# EAGLE design cm_ADA4522 (EAGLE 8.5.0)

## Sheet 1 of 2
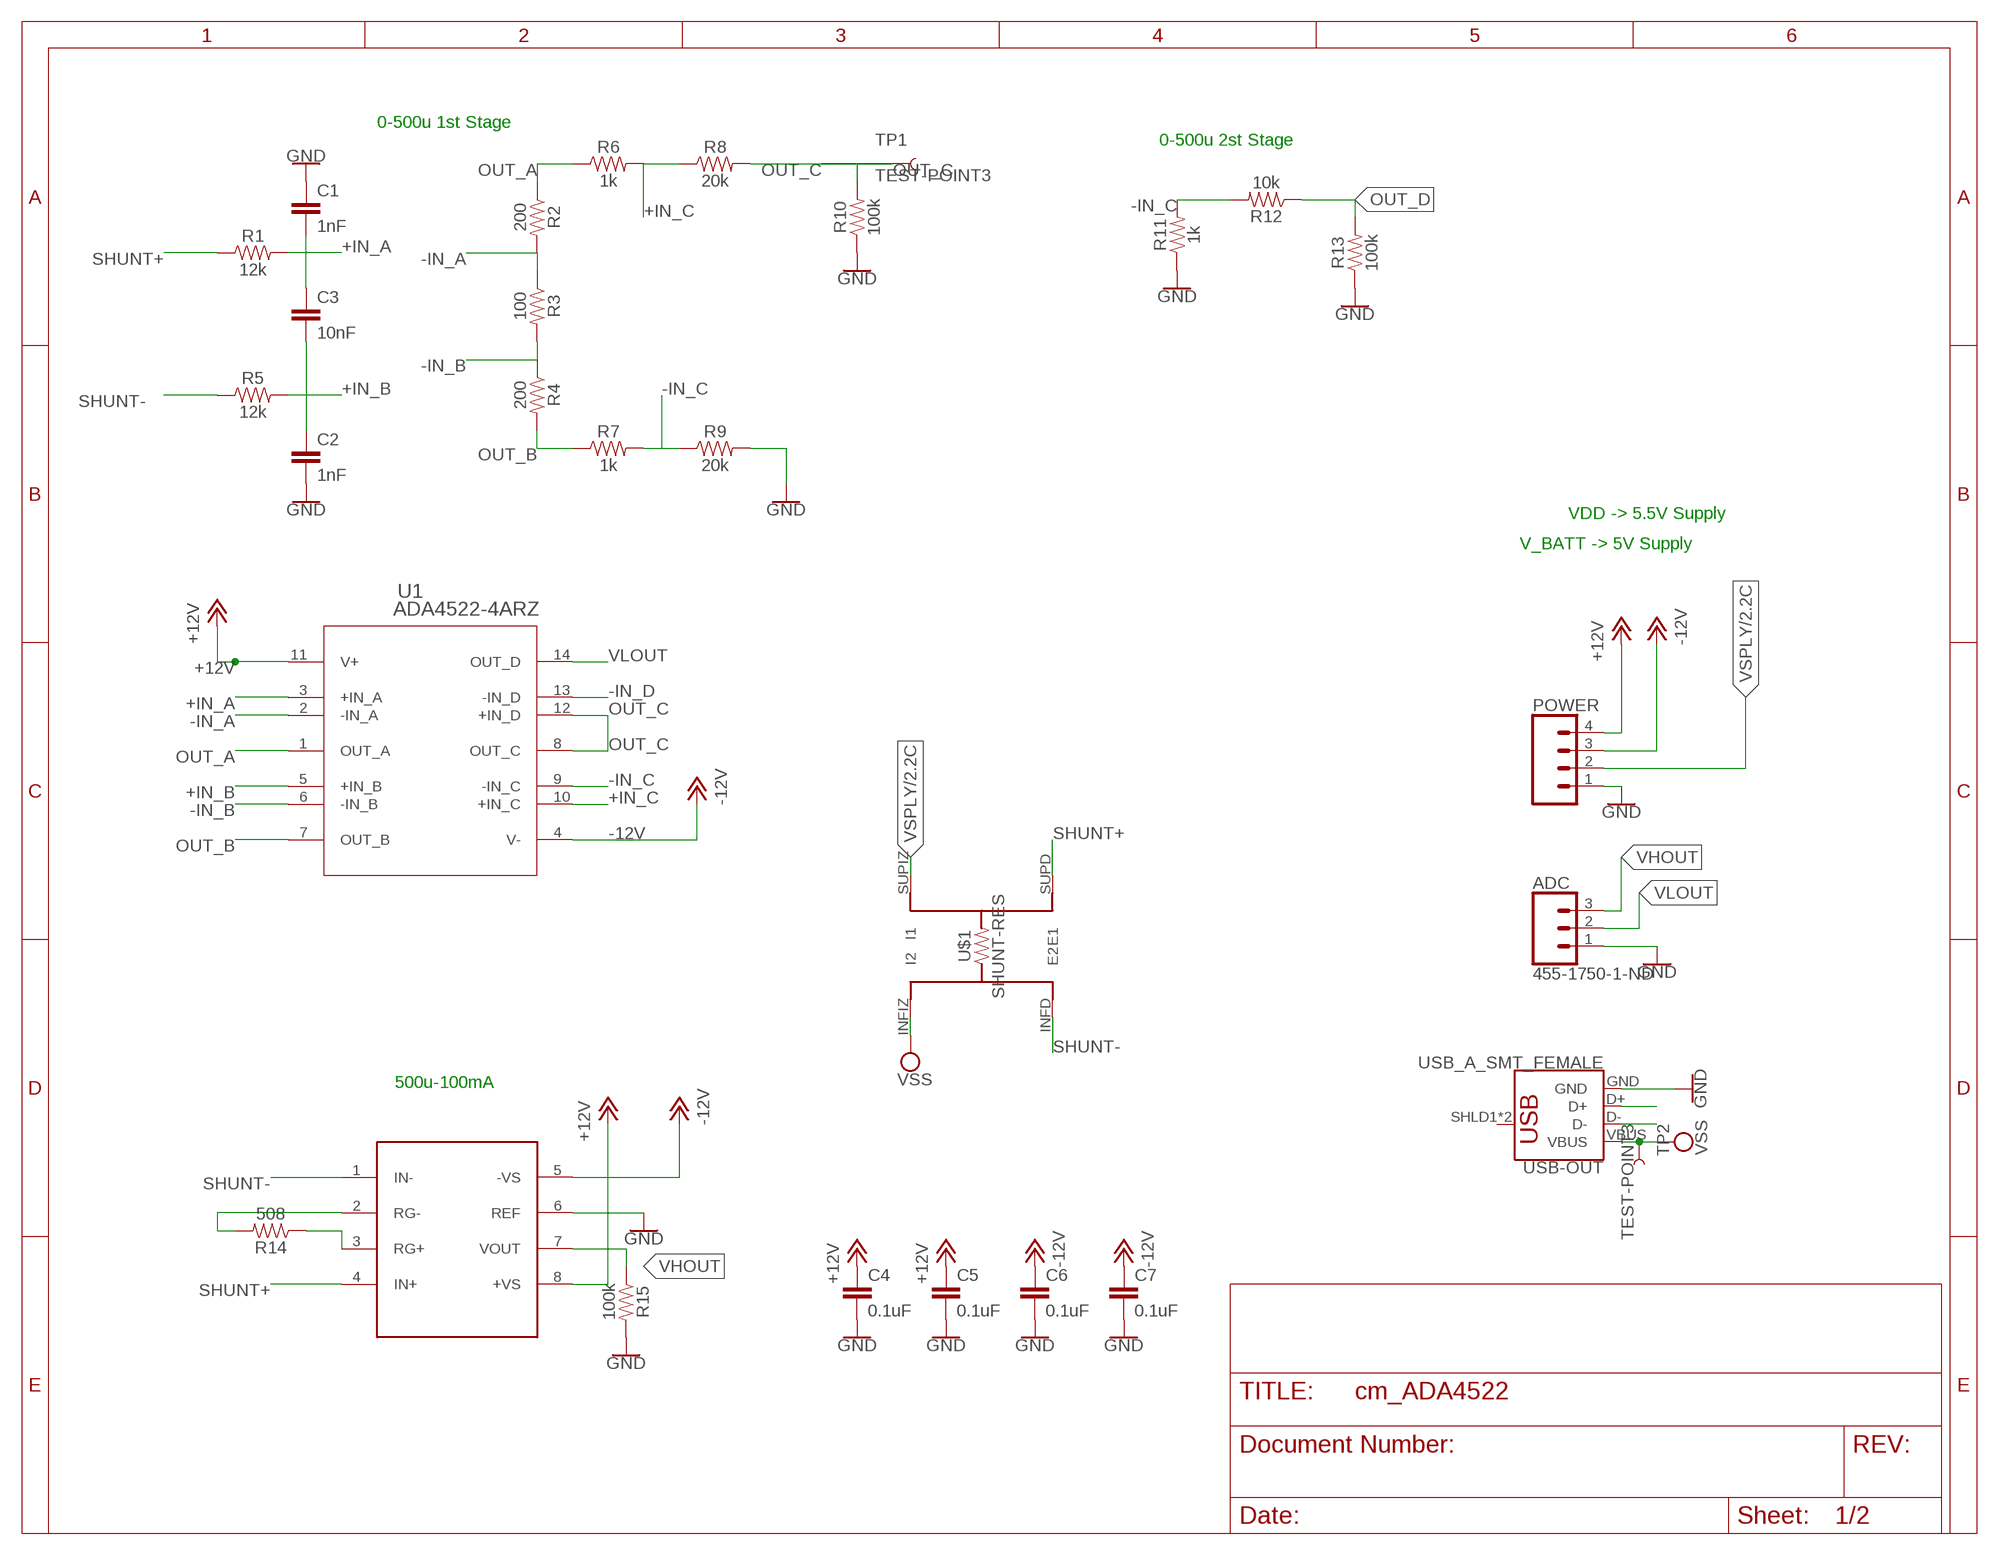
[diagram p0: schematic, sheet 1, part 1 of 2]
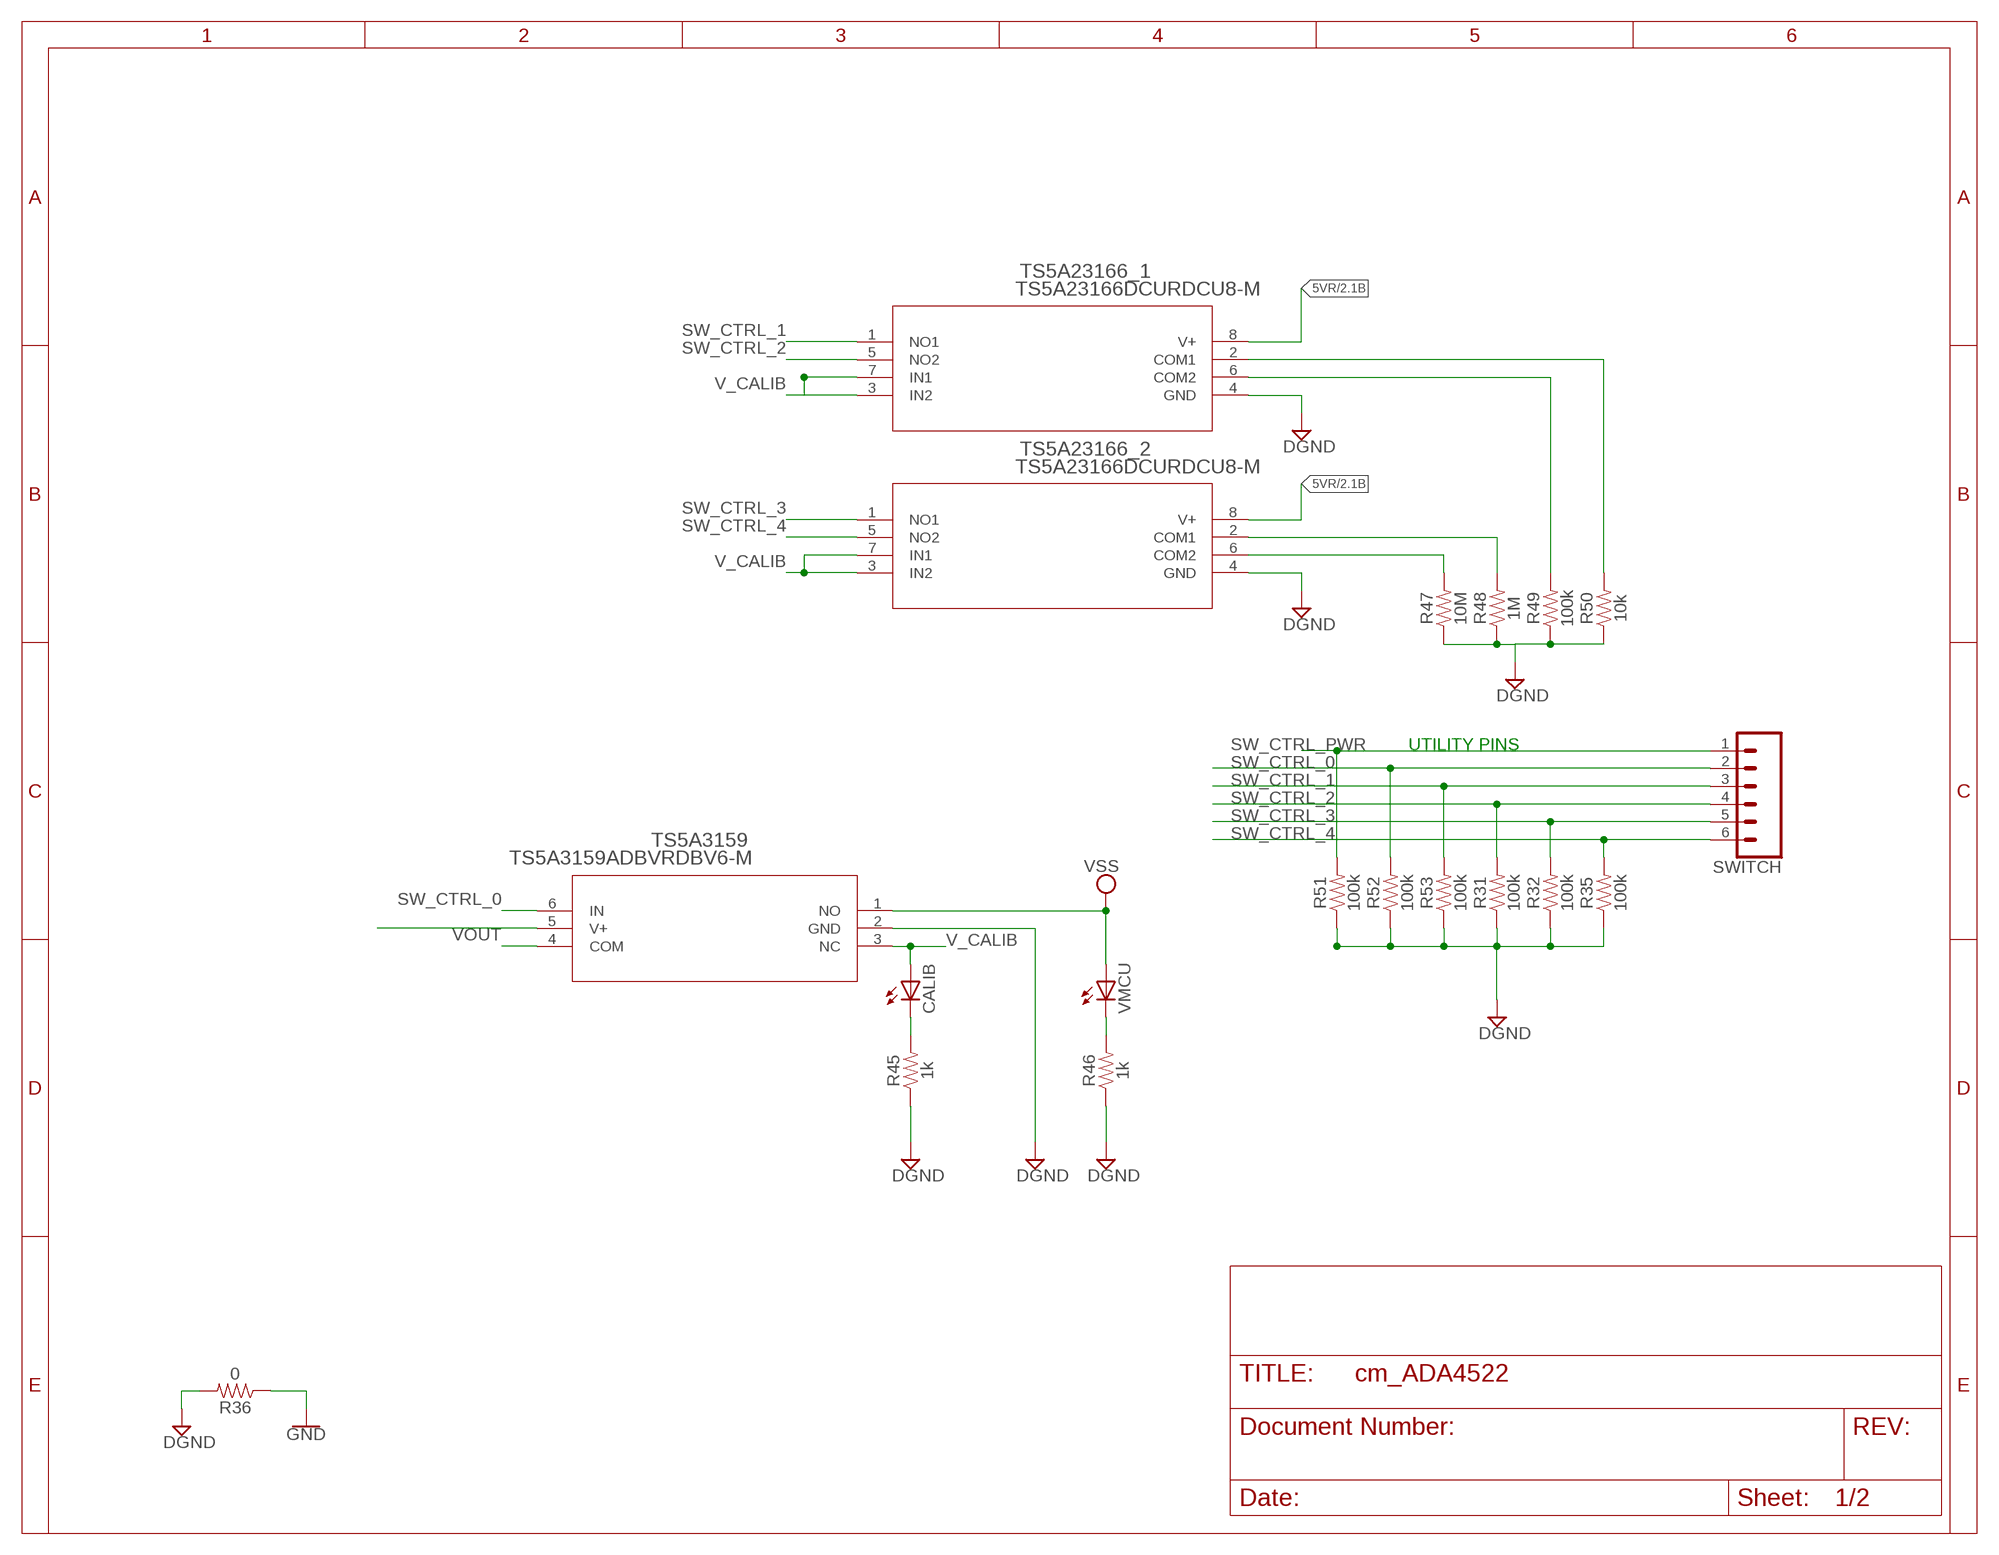
[diagram p1: schematic, sheet 1, part 2 of 2]

### Parts
AD8422  AD8422  [SO08]
ADC  455-1750-1-ND  CONN_03  [1X03]
C1  1nF  3.0NF-0603-50V-5%  [0603]
C2  1nF  3.0NF-0603-50V-5%  [0603]
C3  10nF  3.0NF-0603-50V-5%  [0603]
C4  0.1uF  3.0NF-0603-50V-5%  [0603]
C5  0.1uF  3.0NF-0603-50V-5%  [0603]
C6  0.1uF  3.0NF-0603-50V-5%  [0603]
C7  0.1uF  3.0NF-0603-50V-5%  [0603]
CALIB  LEDCHIPLED_0603  [CHIPLED_0603]
POWER  CONN_04  [1X04]
R1  12k  8.2KOHM-0603-1/10W-5%  [0603]
R2  200  8.2KOHM-0603-1/10W-5%  [0603]
R3  100  8.2KOHM-0603-1/10W-5%  [0603]
R4  200  8.2KOHM-0603-1/10W-5%  [0603]
R5  12k  8.2KOHM-0603-1/10W-5%  [0603]
R6  1k  8.2KOHM-0603-1/10W-5%  [0603]
R7  1k  8.2KOHM-0603-1/10W-5%  [0603]
R8  20k  8.2KOHM-0603-1/10W-5%  [0603]
R9  20k  8.2KOHM-0603-1/10W-5%  [0603]
R10  100k  8.2KOHM-0603-1/10W-5%  [0603]
R11  1k  8.2KOHM-0603-1/10W-5%  [0603]
R12  10k  8.2KOHM-0603-1/10W-5%  [0603]
R13  100k  8.2KOHM-0603-1/10W-5%  [0603]
R14  508  8.2KOHM-0603-1/10W-5%  [0603]
R15  100k  8.2KOHM-0603-1/10W-5%  [0603]
R31  100k  8.2KOHM-0603-1/10W-5%  [0603]
R32  100k  8.2KOHM-0603-1/10W-5%  [0603]
R35  100k  8.2KOHM-0603-1/10W-5%  [0603]
R36  0  8.2KOHM-0603-1/10W-5%  [0603]
R45  1k  8.2KOHM-0603-1/10W-5%  [0603]
R46  1k  8.2KOHM-0603-1/10W-5%  [0603]
R47  10M  8.2KOHM-0603-1/10W-5%  [0603]
R48  1M  8.2KOHM-0603-1/10W-5%  [0603]
R49  100k  8.2KOHM-0603-1/10W-5%  [0603]
R50  10k  8.2KOHM-0603-1/10W-5%  [0603]
R51  100k  8.2KOHM-0603-1/10W-5%  [0603]
R52  100k  8.2KOHM-0603-1/10W-5%  [0603]
R53  100k  8.2KOHM-0603-1/10W-5%  [0603]
SWITCH  CONN_06LONGPADS  [1X06_LONGPADS]
TP1  TEST-POINT3  [PAD.03X.03]
TP2  TEST-POINT3  [PAD.03X.03]
TS5A3159  TS5A3159ADBVRDBV6-M  [DBV6-M]
TS5A23166_1  TS5A23166DCURDCU8-M  [DCU8-M]
TS5A23166_2  TS5A23166DCURDCU8-M  [DCU8-M]
U1  ADA4522-4ARZ  [R_14]
U$1  SHUNT-RES  [HIPREC-SMD-SHUNT]
USB-OUT  USB_A_SMT_FEMALE  [USB-A-S-SILK-FEMALE]
VMCU  LEDCHIPLED_0603  [CHIPLED_0603]

### Nets
5V_F: TS5A3159.5(V+)
5VR: TS5A23166_1.8(V+) TS5A23166_2.8(V+) ; also sheet 2
+12V: AD8422.8(+VS) C4.1 C5.1 POWER.4 U1.11(V+) ; also sheet 2
+IN_A: C1.2 C3.1 R1.2 U1.3(+IN_A)
+IN_B: C2.1 C3.2 R5.2 U1.5(+IN_B)
+IN_C: R6.2 R8.1 U1.10(+IN_C)
-12V: AD8422.5(-VS) C6.1 C7.1 POWER.3 U1.4(V-) ; also sheet 2
-IN_A: R2.2 R3.1 U1.2(-IN_A)
-IN_B: R3.2 R4.1 U1.6(-IN_B)
-IN_C: R7.2 R9.1 R11.2 R12.2 U1.9(-IN_C)
-IN_D: U1.13(-IN_D)
DATA+: USB-OUT.D+ ; also sheet 2
DATA-: USB-OUT.D- ; also sheet 2
DGND: R31.1 R32.1 R35.1 R36.2 R45.1 R46.1 R47.1 R48.1 R49.1 R50.1 R51.1 R52.1 R53.1 TS5A3159.2(GND) TS5A23166_1.4(GND) TS5A23166_2.4(GND) ; also sheet 2
GND: AD8422.6(REF) ADC.1 C1.1 C2.2 C4.2 C5.2 C6.2 C7.2 POWER.1 R9.2 R10.1 R11.1 R13.1 R15.2 R36.1 USB-OUT.GND ; also sheet 2
N$7: AD8422.2(RG-) R14.2
N$10: AD8422.3(RG+) R14.1
N$23: CALIB.C R45.2
N$24: R46.2 VMCU.C
N$30: R50.2 TS5A23166_1.2(COM1)
N$31: R49.2 TS5A23166_1.6(COM2)
N$32: R48.2 TS5A23166_2.2(COM1)
N$33: R47.2 TS5A23166_2.6(COM2)
OUT_A: R2.1 R6.1 U1.1(OUT_A)
OUT_B: R4.2 R7.1 U1.7(OUT_B)
OUT_C: R8.2 R10.2 TP1.P$1 U1.8(OUT_C) U1.12(+IN_D)
OUT_D: R12.1 R13.2
SHUNT+: AD8422.4(IN+) R1.1 U$1.SUPD(E1)
SHUNT-: AD8422.1(IN-) R5.1 U$1.INFD(E2)
SW_CTRL_0: R52.2 SWITCH.2 TS5A3159.6(IN)
SW_CTRL_1: R53.2 SWITCH.3 TS5A23166_1.1(NO1)
SW_CTRL_2: R31.2 SWITCH.4 TS5A23166_1.5(NO2)
SW_CTRL_3: R32.2 SWITCH.5 TS5A23166_2.1(NO1)
SW_CTRL_4: R35.2 SWITCH.6 TS5A23166_2.5(NO2)
SW_CTRL_PWR: R51.2 SWITCH.1 ; also sheet 2
V_CALIB: CALIB.A TS5A3159.3(NC) TS5A23166_1.3(IN2) TS5A23166_1.7(IN1) TS5A23166_2.3(IN2) TS5A23166_2.7(IN1)
VHOUT: AD8422.7(VOUT) ADC.3 R15.1
VLOUT: ADC.2 U1.14(OUT_D)
VOUT: TS5A3159.4(COM)
VSPLY: POWER.2 U$1.SUPIZ(I1) ; also sheet 2
VSS: TP2.P$1 TS5A3159.1(NO) U$1.INFIZ(I2) USB-OUT.VBUS VMCU.A
Unconnected: USB-OUT.SHLD1(SHIELD) USB-OUT.SHLD2(SHIELD)

### Notes on the sheet
- 0-500u 1st Stage
- 0-500u 2st Stage
- VDD -> 5.5V Supply
- V_BATT -> 5V Supply
- UTILITY PINS
- 500u-100mA

## Sheet 2 of 2
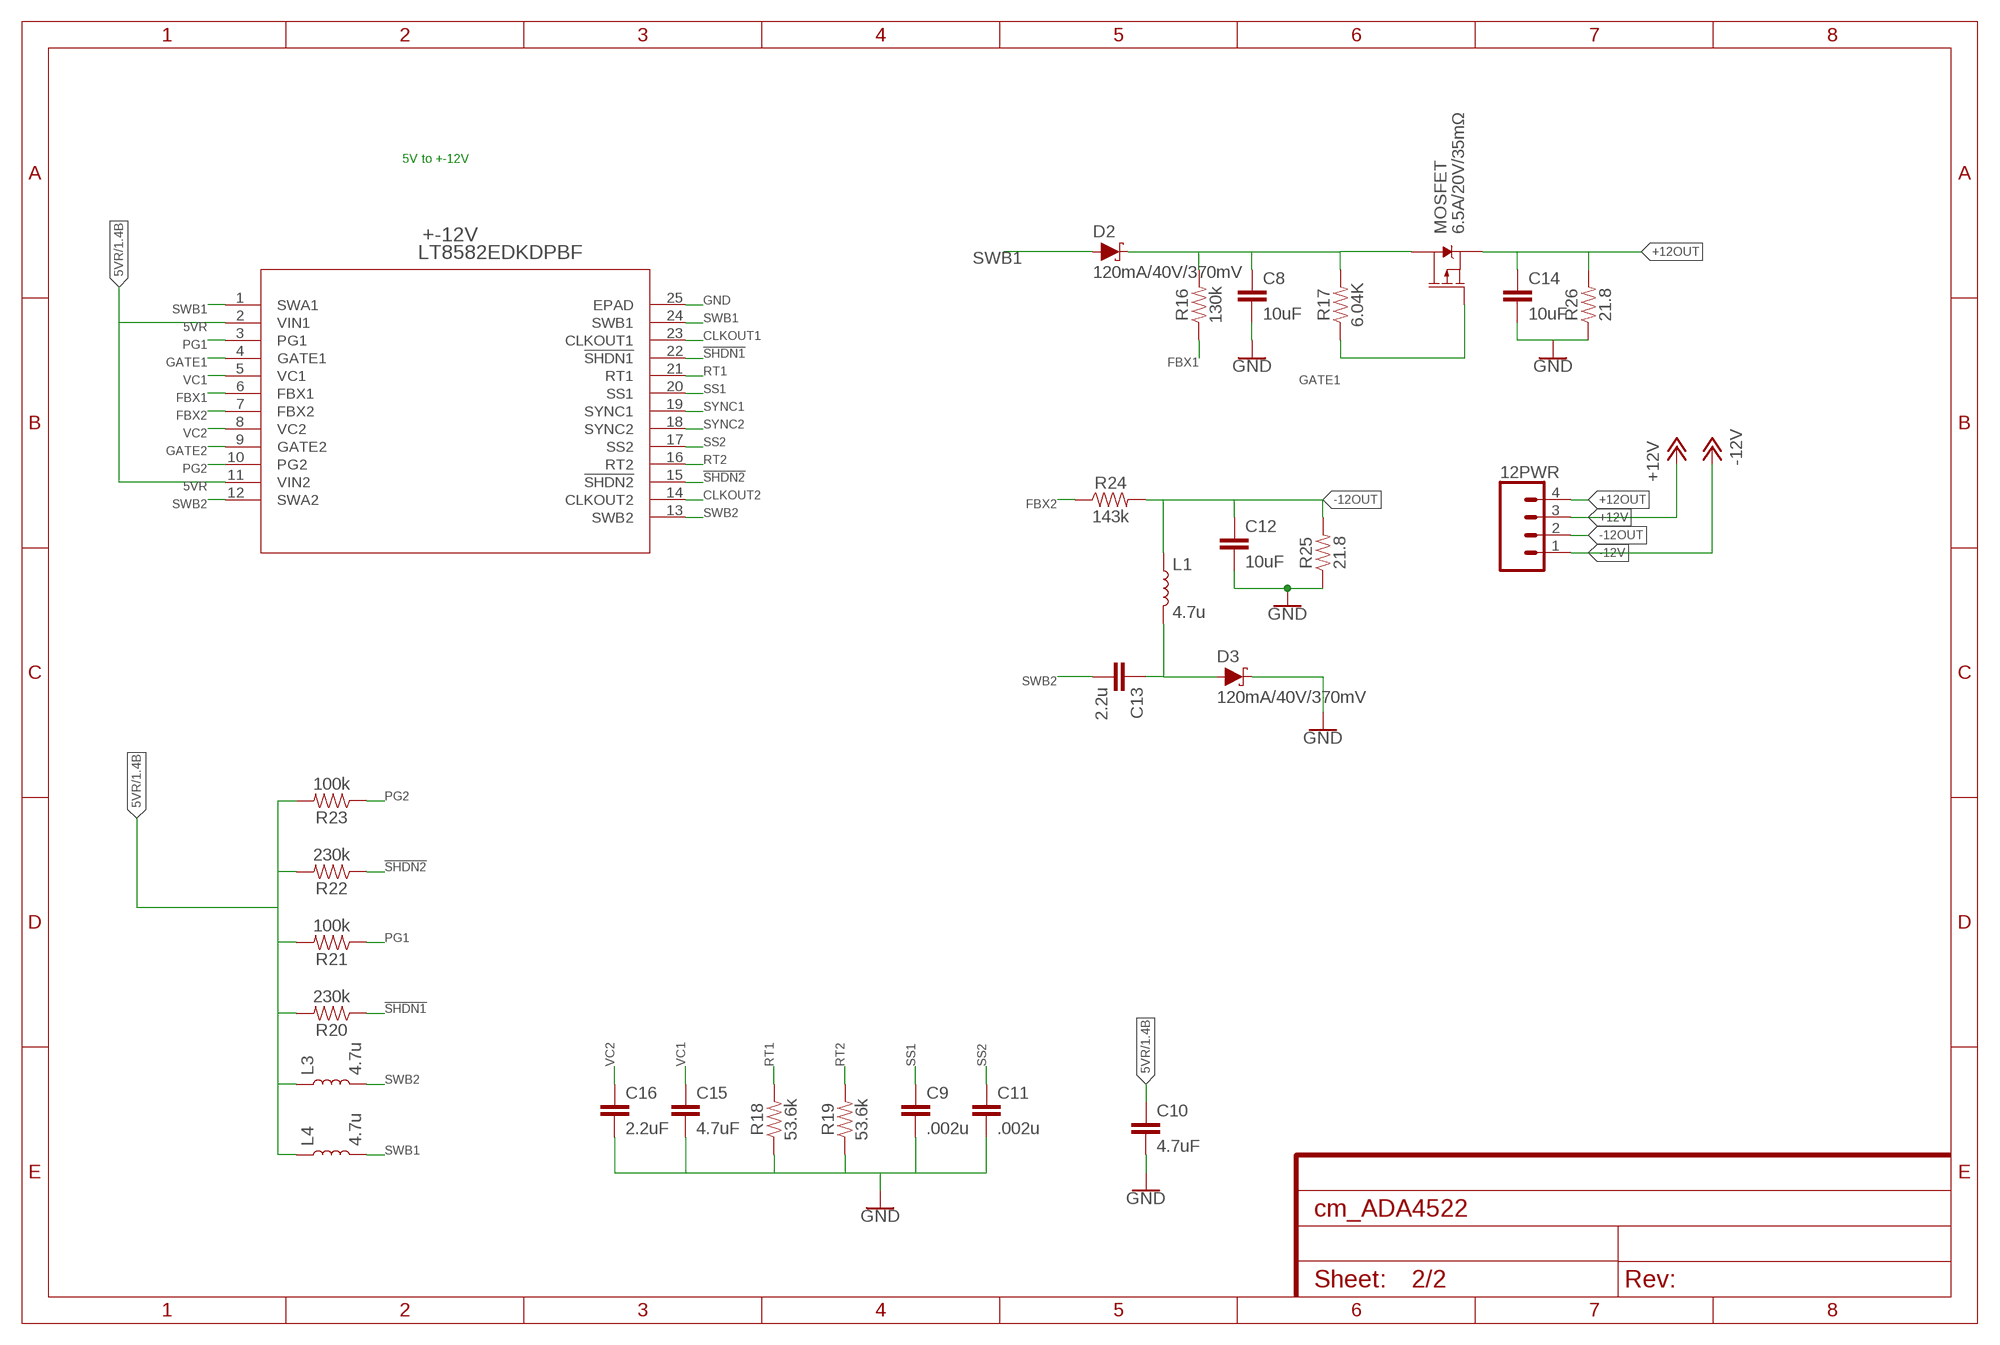
[diagram p2: schematic, sheet 2, part 1 of 2]
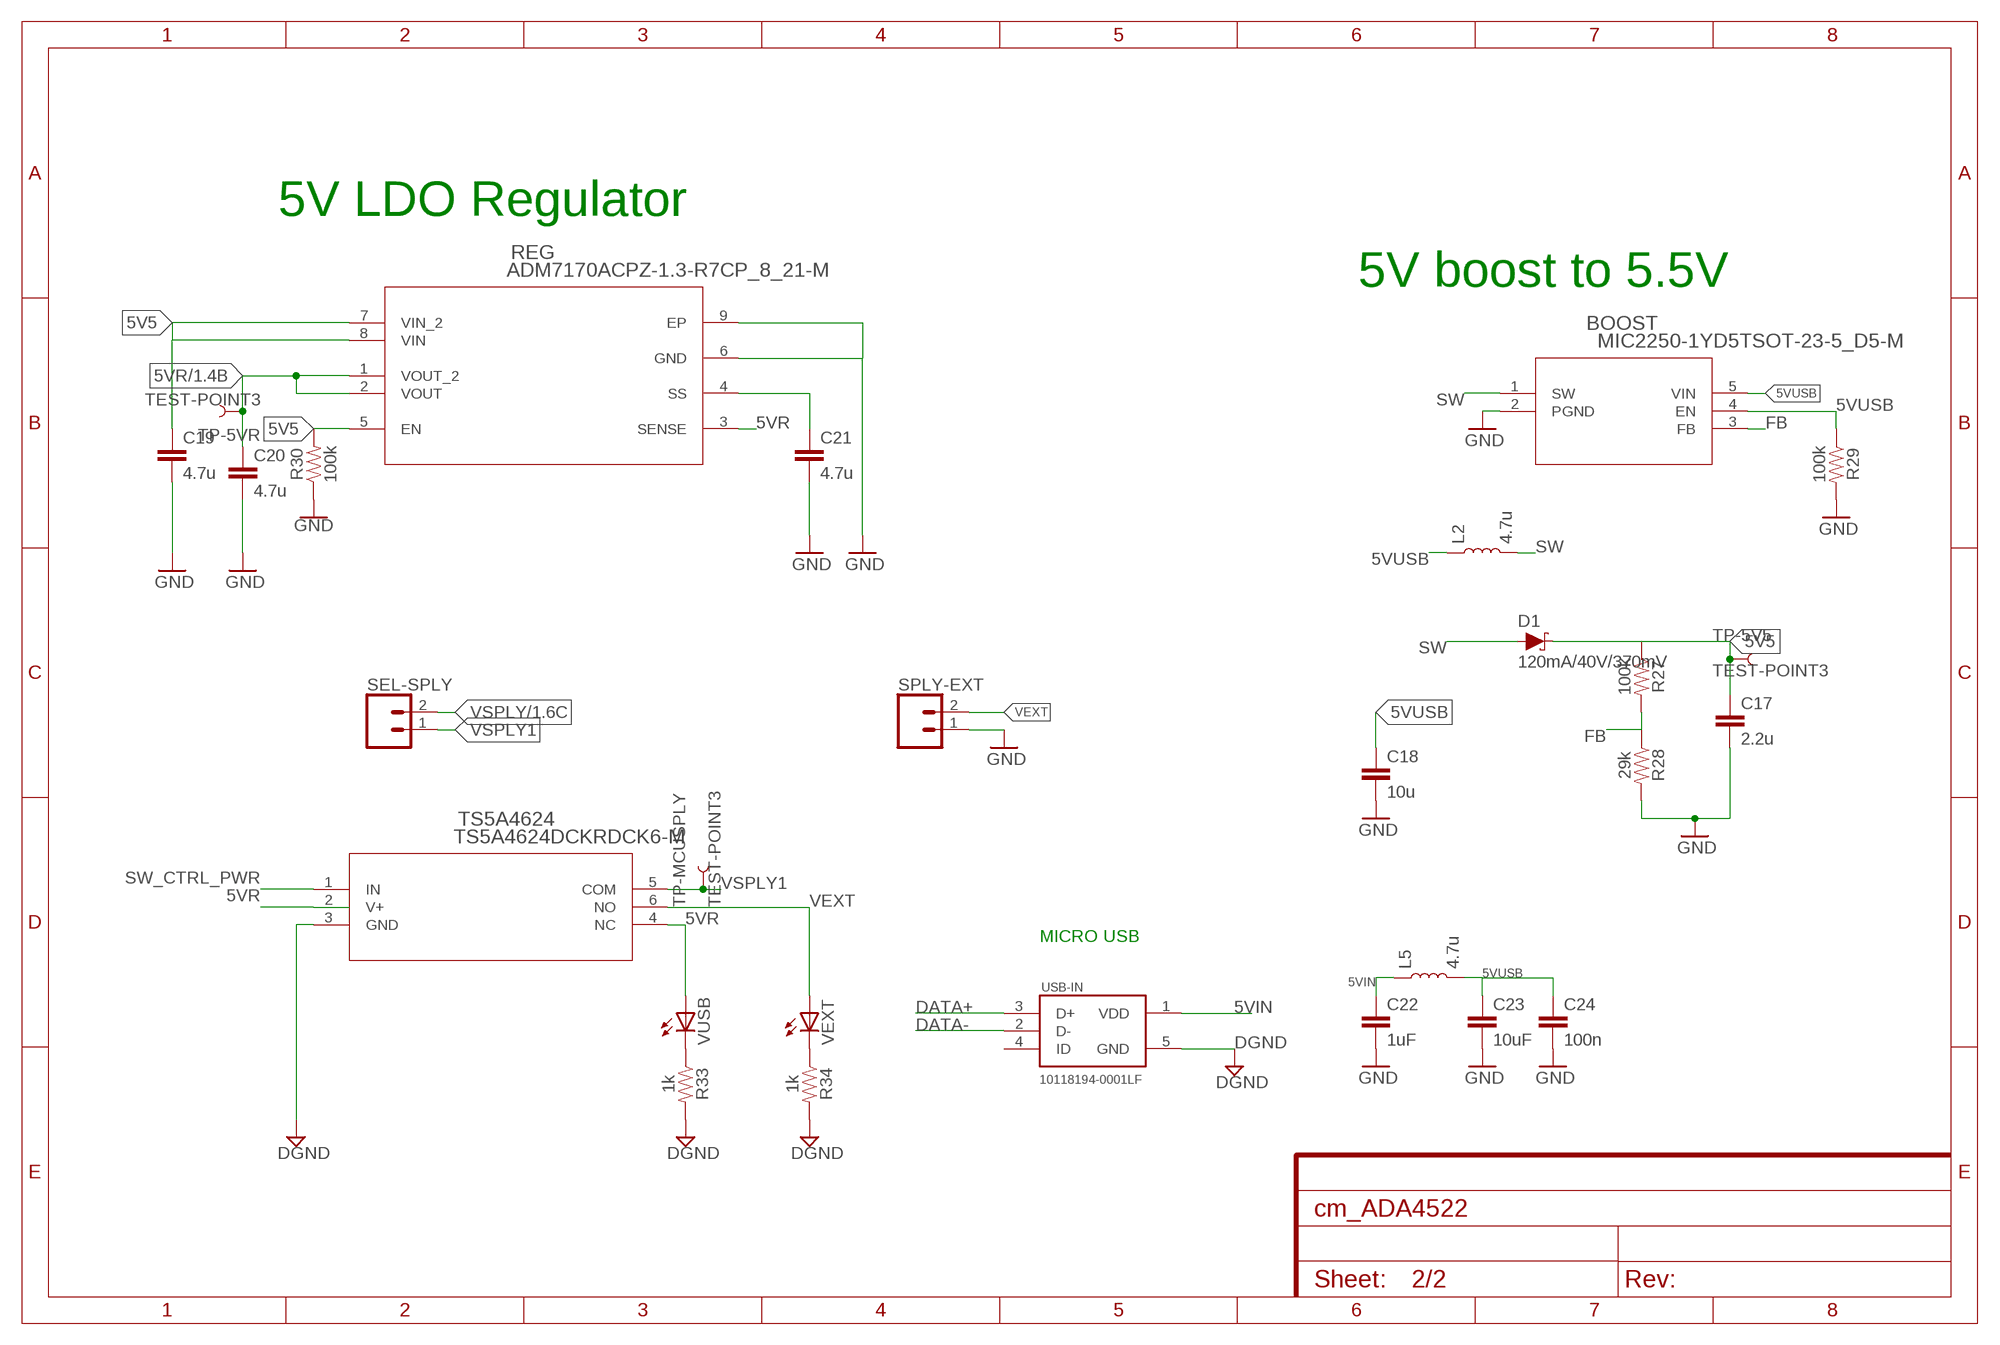
[diagram p3: schematic, sheet 2, part 2 of 2]

### Parts
12PWR  CONN_04  [1X04]
+-12V  LT8582EDKDPBF  [DFN-24_DKD]
BOOST  MIC2250-1YD5TSOT-23-5_D5-M  [TSOT-23-5_D5-M]
C8  10uF  10UF-0603-6.3V-20%  [0603]
C9  .002u  10UF-0603-6.3V-20%  [0603]
C10  4.7uF  10UF-0603-6.3V-20%  [0603]
C11  .002u  10UF-0603-6.3V-20%  [0603]
C12  10uF  10UF-0603-6.3V-20%  [0603]
C13  2.2u  10UF-0603-6.3V-20%  [0603]
C14  10uF  10UF-0603-6.3V-20%  [0603]
C15  4.7uF  10UF-0603-6.3V-20%  [0603]
C16  2.2uF  10UF-0603-6.3V-20%  [0603]
C17  2.2u  10UF-0603-6.3V-20%  [0603]
C18  10u  10UF-0603-6.3V-20%  [0603]
C19  4.7u  10UF-0603-6.3V-20%  [0603]
C20  4.7u  10UF-0603-6.3V-20%  [0603]
C21  4.7u  10UF-0603-6.3V-20%  [0603]
C22  1uF  10UF-0603-6.3V-20%  [0603]
C23  10uF  10UF-0603-6.3V-20%  [0603]
C24  100n  10UF-0603-6.3V-20%  [0603]
D1  120mA/40V/370mV  DIODE-SCHOTTKY-RB751S40  [SOD-523]
D2  120mA/40V/370mV  DIODE-SCHOTTKY-RB751S40  [SOD-523]
D3  120mA/40V/370mV  DIODE-SCHOTTKY-RB751S40  [SOD-523]
L1  4.7u  1239AS-H  [252012C]
L2  4.7u  1239AS-H  [252012C]
L3  4.7u  1239AS-H  [252012C]
L4  4.7u  1239AS-H  [252012C]
L5  4.7u  1239AS-H  [252012C]
MOSFET  6.5A/20V/35mΩ  MOSFET_PCH-NDS8434  [SO08]
R16  130k  150KOHM-0603-1/10W-1%  [0603]
R17  6.04K  150KOHM-0603-1/10W-1%  [0603]
R18  53.6k  150KOHM-0603-1/10W-1%  [0603]
R19  53.6k  150KOHM-0603-1/10W-1%  [0603]
R20  230k  150KOHM-0603-1/10W-1%  [0603]
R21  100k  150KOHM-0603-1/10W-1%  [0603]
R22  230k  150KOHM-0603-1/10W-1%  [0603]
R23  100k  150KOHM-0603-1/10W-1%  [0603]
R24  143k  150KOHM-0603-1/10W-1%  [0603]
R25  21.8  150KOHM-0603-1/10W-1%  [0603]
R26  21.8  150KOHM-0603-1/10W-1%  [0603]
R27  100k  150KOHM-0603-1/10W-1%  [0603]
R28  29k  150KOHM-0603-1/10W-1%  [0603]
R29  100k  150KOHM-0603-1/10W-1%  [0603]
R30  100k  150KOHM-0603-1/10W-1%  [0603]
R33  1k  150KOHM-0603-1/10W-1%  [0603]
R34  1k  150KOHM-0603-1/10W-1%  [0603]
REG  ADM7170ACPZ-1.3-R7CP_8_21-M  [CP_8_21-M]
SEL-SPLY  CONN_02  [1X02]
SPLY-EXT  CONN_02  [1X02]
TP-5V5  TEST-POINT3  [PAD.03X.03]
TP-5VR  TEST-POINT3  [PAD.03X.03]
TP-MCUSPLY  TEST-POINT3  [PAD.03X.03]
TS5A4624  TS5A4624DCKRDCK6-M  [DCK6-M]
USB-IN  10118194-0001LF  [FRAMATOME_10118194-0001LF]
VEXT  LEDCHIPLED_0603  [CHIPLED_0603]
VUSB  LEDCHIPLED_0603  [CHIPLED_0603]

### Nets
5V5: C17.1 C19.1 D1.C R27.1 R30.2 REG.5(EN) REG.7(VIN_2) REG.8(VIN) TP-5V5.P$1
5VIN: C22.1 L5.1 USB-IN.1(VDD)
5VR: +-12V.2(VIN1) +-12V.11(VIN2) C10.1 C20.1 L3.1 L4.1 R20.2 R21.2 R22.2 R23.2 REG.1(VOUT_2) REG.2(VOUT) REG.3(SENSE) TP-5VR.P$1 TS5A4624.2(V+) TS5A4624.4(NC) VUSB.A ; also sheet 1
5VUSB: BOOST.4(EN) BOOST.5(VIN) C18.1 C23.1 C24.1 L2.1 L5.2 R29.1
!SHDN1: +-12V.22(!SHDN1) R20.1
!SHDN2: +-12V.15(!SHDN2) R22.1
+12OUT: 12PWR.4 C14.1 MOSFET.1(S) MOSFET.2(S) MOSFET.3(S) R26.2
+12V: 12PWR.3 ; also sheet 1
-12OUT: 12PWR.2 C12.1 L1.1 R24.2 R25.2
-12V: 12PWR.1 ; also sheet 1
CLKOUT1: +-12V.23(CLKOUT1)
CLKOUT2: +-12V.14(CLKOUT2)
DATA+: USB-IN.3(D+) ; also sheet 1
DATA-: USB-IN.2(D-) ; also sheet 1
DGND: R33.2 R34.2 TS5A4624.3(GND) USB-IN.5(GND) ; also sheet 1
FB: BOOST.3(FB) R27.2 R28.1
FBX1: +-12V.6(FBX1) R16.1
FBX2: +-12V.7(FBX2) R24.1
GATE1: +-12V.4(GATE1) MOSFET.4(G) R17.1
GATE2: +-12V.9(GATE2)
GND: +-12V.25(EPAD) BOOST.2(PGND) C8.2 C9.2 C10.2 C11.2 C12.2 C14.2 C15.2 C16.2 C17.2 C18.2 C19.2 C20.2 C21.2 C22.2 C23.2 C24.2 D3.C R18.1 R19.1 R25.1 R26.1 R28.2 R29.2 R30.1 REG.6(GND) REG.9(EP) SPLY-EXT.1 ; also sheet 1
N$12: R33.1 VUSB.C
N$13: C8.1 D2.C MOSFET.5(D) MOSFET.6(D) MOSFET.7(D) MOSFET.8(D) R16.2 R17.2
N$14: C13.1 D3.A L1.2
N$19: R34.1 VEXT.C
N$20: C21.1 REG.4(SS)
PG1: +-12V.3(PG1) R21.1
PG2: +-12V.10(PG2) R23.1
RT1: +-12V.21(RT1) R18.2
RT2: +-12V.16(RT2) R19.2
SS1: +-12V.20(SS1) C9.1
SS2: +-12V.17(SS2) C11.1
SW: BOOST.1(SW) D1.A L2.2
SW_CTRL_PWR: TS5A4624.1(IN) ; also sheet 1
SWB1: +-12V.1(SWA1) +-12V.24(SWB1) D2.A L4.2
SWB2: +-12V.12(SWA2) +-12V.13(SWB2) C13.2 L3.2
SYNC1: +-12V.19(SYNC1)
SYNC2: +-12V.18(SYNC2)
VC1: +-12V.5(VC1) C15.1
VC2: +-12V.8(VC2) C16.1
VEXT: SPLY-EXT.2 TS5A4624.6(NO) VEXT.A
VSPLY: SEL-SPLY.2 ; also sheet 1
VSPLY1: SEL-SPLY.1 TP-MCUSPLY.P$1 TS5A4624.5(COM)
Unconnected: USB-IN.4(ID)

### Notes on the sheet
- 5V to +-12V
- 5V LDO Regulator
- 5V boost to 5.5V
- MICRO USB

## Library data of the parts
12PWR POWER = SparkFun-Connectors:CONN_04: Multi connection point. Often used as Generic Header-pin footprint for 0.1 inch spaced/style header connections On any of the 0.1 inch spaced packages, you can populate with these: Break Away Headers - Straight <https://www.sparkfun.com/products/116> (PRT-00116) Break Away Male Headers - Right Angle <https://www.sparkfun.com/products/553> (PRT-00553) Female Headers <https://www.sparkfun.com/products/115> (PRT-00115) Break Away Headers - Machine Pin <https://www.sparkfun.com/products/117> (PRT-00117) Break Away Female Headers - Swiss Machine Pin <https://www.sparkfun.com/products/743> (PRT-00743) For SCREWTERMINALS and SPRING TERMINALS visit here: Screw Terimnals on SparkFun.com <https://www.sparkfun.com/search/results?term=Screw+Terminals> (5mm/3.5mm/2.54mm spacing) This device is also useful as a general connection point to wire up your design to another part of your project. Our various solder wires solder well into these plated through hole pads. Hook-Up Wire - Assortment (Stranded, 22 AWG) <https://www.sparkfun.com/products/11375> (PRT-11375) Hook-Up Wire - Assortment (Solid Core, 22 AWG) <https://www.sparkfun.com/products/11367> (PRT-11367) View the entire wire category on our website here <https://www.sparkfun.com/categories/141> Special notes: Molex polarized connector foot print use with SKU : PRT-08231 with associated crimp pins and housings. 1MM SMD Version SKU: PRT-10208; PROD_ID: CONN-09696
+-12V = LT8582:LT8582EDKDPBF; MANUFACTURER_PART_NUMBER: LT8582EDKD#PBF; VENDOR: Linear Technology
AD8422 = SparkFun-IC-Amplifiers:AD8422
ADC = SparkFun-Connectors:CONN_03: Multi connection point. Often used as Generic Header-pin footprint for 0.1 inch spaced/style header connections On any of the 0.1 inch spaced packages, you can populate with these: Break Away Headers - Straight <https://www.sparkfun.com/products/116> (PRT-00116) Break Away Male Headers - Right Angle <https://www.sparkfun.com/products/553> (PRT-00553) Female Headers <https://www.sparkfun.com/products/115> (PRT-00115) Break Away Headers - Machine Pin <https://www.sparkfun.com/products/117> (PRT-00117) Break Away Female Headers - Swiss Machine Pin <https://www.sparkfun.com/products/743> (PRT-00743) Stackable Header - 3 Pin (Female, 0.1") <https://www.sparkfun.com/products/13875> (PRT-13875) For SCREWTERMINALS and SPRING TERMINALS visit here: Screw Terimnals on SparkFun.com <https://www.sparkfun.com/search/results?term=Screw+Terminals> (5mm/3.5mm/2.54mm spacing) This device is also useful as a general connection point to wire up your design to another part of your project. Our various solder wires solder well into these plated through hole pads. Hook-Up Wire - Assortment (Stranded, 22 AWG) <https://www.sparkfun.com/products/11375> (PRT-11375) Hook-Up Wire - Assortment (Solid Core, 22 AWG) <https://www.sparkfun.com/products/11367> (PRT-11367) View the entire wire category on our website here <https://www.sparkfun.com/categories/141> Special notes: Molex polarized connector foot print use with SKU : PRT-08232 with associated crimp pins and housings.; PROD_ID: XXX-00000
BOOST = texas_instruments:MIC2250-1YD5; MANUFACTURER_PART_NUMBER: MIC22501YD5; VENDOR: Micrel
C1-C7 = SparkFun-Capacitors:3.0NF: 3.0nF (3nF, 3000pF) ceramic capacitors A capacitor is a passive two-terminal electrical component used to store electrical energy temporarily in an electric field.; PROD_ID: CAP-13515; VALUE: 3.0nF
C8 C12 C14 C23 = SparkFun-Capacitors:10UF: 10.0µF ceramic capacitors A capacitor is a passive two-terminal electrical component used to store electrical energy temporarily in an electric field.; PROD_ID: CAP-11015
C9-C11 C13 C15-C22 C24 = SparkFun-Capacitors:10UF: 10.0µF ceramic capacitors A capacitor is a passive two-terminal electrical component used to store electrical energy temporarily in an electric field.; PROD_ID: CAP-11015; VALUE: 10uF
CALIB VEXT VMCU VUSB = led:LED: LED OSRAM: - CHIPLED LG R971, LG N971, LY N971, LG Q971, LY Q971, LO R971, LY R971 LH N974, LH R974 LS Q976, LO Q976, LY Q976 LO Q996 - Hyper CHIPLED LW Q18S LB Q993, LB Q99A, LB R99A - SideLED LS A670, LO A670, LY A670, LG A670, LP A670 LB A673, LV A673, LT A673, LW A673 LH A674 LY A675 LS A676, LA A676, LO A676, LY A676, LW A676 LS A679, LY A679, LG A679 - Hyper Micro SIDELED® LS Y876, LA Y876, LO Y876, LY Y876 LT Y87S - SmartLED LW L88C, LW L88S LB L89C, LB L89S, LG L890 LS L89K, LO L89K, LY L89K LS L896, LA L896, LO L896, LY L896 - TOPLED LS T670, LO T670, LY T670, LG T670, LP T670 LSG T670, LSP T670, LSY T670, LOP T670, LYG T670 LG T671, LOG T671, LSG T671 LB T673, LV T673, LT T673, LW T673 LH T674 LS T676, LA T676, LO T676, LY T676, LB T676, LH T676, LSB T676, LW T676 LB T67C, LV T67C, LT T67C, LS T67K, LO T67K, LY T67K, LW E67C LS E67B, LA E67B, LO E67B, LY E67B, LB E67C, LV E67C, LT E67C LW T67C LS T679, LY T679, LG T679 LS T770, LO T770, LY T770, LG T770, LP T770 LB T773, LV T773, LT T773, LW T773 LH T774 LS E675, LA E675, LY E675, LS T675 LS T776, LA T776, LO T776, LY T776, LB T776 LHGB T686 LT T68C, LB T68C - Hyper Mini TOPLED® LB M676 - Mini TOPLED Santana® LG M470 LS M47K, LO M47K, LY M47K Source: http://www.osram.convergy.de LUXEON: - LUMILED® LXK2-PW12-R00, LXK2-PW12-S00, LXK2-PW14-U00, LXK2-PW14-V00 LXK2-PM12-R00, LXK2-PM12-S00, LXK2-PM14-U00 LXK2-PE12-Q00, LXK2-PE12-R00, LXK2-PE12-S00, LXK2-PE14-T00, LXK2-PE14-U00 LXK2-PB12-K00, LXK2-PB12-L00, LXK2-PB12-M00, LXK2-PB14-N00, LXK2-PB14-P00, LXK2-PB14-Q00 LXK2-PR12-L00, LXK2-PR12-M00, LXK2-PR14-Q00, LXK2-PR14-R00 LXK2-PD12-Q00, LXK2-PD12-R00, LXK2-PD12-S00 LXK2-PH12-R00, LXK2-PH12-S00 LXK2-PL12-P00, LXK2-PL12-Q00, LXK2-PL12-R00 Source: www.luxeon.com KINGBRIGHT: KA-3528ASYC Source: www.kingbright.com
D1-D3 = SparkFun-DiscreteSemi:DIODE-SCHOTTKY: Schottky diode A Schottky diode is a semiconductor diode which has a low forward voltage drop and a very fast switching action.; PROD_ID: DIO-11018
L1-L5 = SparkFun-Coils:1239AS-H
MOSFET = SparkFun-DiscreteSemi:MOSFET_PCH: P-channel MOSFETs Voltage controlled devices that allow control of high current outputs. SparkFun Products: SparkFun ESP32 Thing <https://www.sparkfun.com/products/13907> SparkFun ESP8266 Thing <https://www.sparkfun.com/products/13231>; PROD_ID: TRANS-08355
R1-R15 R31 R32 R35 R36 R45-R53 = SparkFun-Resistors:8.2KOHM: 8.2kΩ resistor A resistor is a passive two-terminal electrical component that implements electrical resistance as a circuit element. Resistors act to reduce current flow, and, at the same time, act to lower voltage levels within circuits. - Wikipedia; PROD_ID: RES-10646; VALUE: 8.2k
R16-R30 R33 R34 = SparkFun-Resistors:150KOHM: 150kΩ resistor A resistor is a passive two-terminal electrical component that implements electrical resistance as a circuit element. Resistors act to reduce current flow, and, at the same time, act to lower voltage levels within circuits. - Wikipedia; PROD_ID: RES-09117; VALUE: 150k
REG = analog_devices:ADM7170ACPZ-1.3-R7; MANUFACTURER_PART_NUMBER: ADM7170ACPZ1.3R7; VENDOR: Analog Devices Inc
SEL-SPLY SPLY-EXT = SparkFun-Connectors:CONN_02: Multi connection point. Often used as Generic Header-pin footprint for 0.1 inch spaced/style header connections On any of the 0.1 inch spaced packages, you can populate with these: Break Away Headers - Straight <https://www.sparkfun.com/products/116> (PRT-00116) Break Away Male Headers - Right Angle <https://www.sparkfun.com/products/553> (PRT-00553) Female Headers <https://www.sparkfun.com/products/115> (PRT-00115) Break Away Headers - Machine Pin <https://www.sparkfun.com/products/117> (PRT-00117) Break Away Female Headers - Swiss Machine Pin <https://www.sparkfun.com/products/743> (PRT-00743) For SCREWTERMINALS and SPRING TERMINALS visit here: Screw Terimnals on SparkFun.com <https://www.sparkfun.com/search/results?term=Screw+Terminals> (5mm/3.5mm/2.54mm spacing) This device is also useful as a general connection point to wire up your design to another part of your project. Our various solder wires solder well into these plated through hole pads. Hook-Up Wire - Assortment (Stranded, 22 AWG) <https://www.sparkfun.com/products/11375> (PRT-11375) Hook-Up Wire - Assortment (Solid Core, 22 AWG) <https://www.sparkfun.com/products/11367> (PRT-11367) View the entire wire category on our website here <https://www.sparkfun.com/categories/141> Special notes: Molex polarized connector foot print use with: PRT-08233 with associated crimp pins and housings. 2.54_SCREWTERM for use with PRT-10571. 3.5mm Screw Terminal footprints for PRT-08084 5mm Screw Terminal footprints for use with PRT-08432
SWITCH = SparkFun-Connectors:CONN_06: Multi connection point. Often used as Generic Header-pin footprint for 0.1 inch spaced/style header connections On any of the 0.1 inch spaced packages, you can populate with these: Break Away Headers - Straight <https://www.sparkfun.com/products/116> (PRT-00116) Break Away Male Headers - Right Angle <https://www.sparkfun.com/products/553> (PRT-00553) Female Headers <https://www.sparkfun.com/products/115> (PRT-00115) Break Away Headers - Machine Pin <https://www.sparkfun.com/products/117> (PRT-00117) Break Away Female Headers - Swiss Machine Pin <https://www.sparkfun.com/products/743> (PRT-00743) Arduino Stackable Header - 6 Pin <https://www.sparkfun.com/products/9280> (PRT-09280) For SCREWTERMINALS and SPRING TERMINALS visit here: Screw Terimnals on SparkFun.com <https://www.sparkfun.com/search/results?term=Screw+Terminals> (5mm/3.5mm/2.54mm spacing) This device is also useful as a general connection point to wire up your design to another part of your project. Our various solder wires solder well into these plated through hole pads. Hook-Up Wire - Assortment (Stranded, 22 AWG) <https://www.sparkfun.com/products/11375> (PRT-11375) Hook-Up Wire - Assortment (Solid Core, 22 AWG) <https://www.sparkfun.com/products/11367> (PRT-11367) View the entire wire category on our website here <https://www.sparkfun.com/categories/141>
TP1 TP2 TP-5V5 TP-5VR TP-MCUSPLY = SparkFun-Connectors:TEST-POINT: SparkFun Test Points Bare copper test points for troubleshooting or In-Circuit-Testing. These are used by our Production team for verifying production board runs using pogo-pins on test beds. SparkFun Products: SparkFun LSM9DS1 Breakout <https://www.sparkfun.com/products/13284> SparkFun PSOC <https://www.sparkfun.com/products/13714> SparkFun Load Cell Amplifier <https://www.sparkfun.com/products/13879>
TS5A3159 = texas_instruments:TS5A3159ADBVR; MANUFACTURER_PART_NUMBER: TS5A3159ADBVR; VENDOR: Texas Instruments
TS5A4624 = texas_instruments:TS5A4624DCKR; MANUFACTURER_PART_NUMBER: TS5A4624DCKR; VENDOR: Texas Instruments
TS5A23166_1 TS5A23166_2 = texas_instruments:TS5A23166DCUR; MANUFACTURER_PART_NUMBER: TS5A23166DCUR; VENDOR: Texas Instruments
U1 = ADA4522-4:ADA4522-4ARZ; MANUFACTURER_PART_NUMBER: ADA45224ARZ; VENDOR: Analog Devices Inc
U$1 = SparkFun-Resistors:SHUNT-RES
USB-IN = 10118194-0001LF:10118194-0001LF: Conn Micro USB Type B RCP 5 POS 0.65mm Solder RA SMD 5 Terminal 1 Port T/R; AVAILABILITY: Good; DESCRIPTION: Conn Micro USB Type B RCP 5 POS 0.65mm Solder RA SMD 5 Terminal 1 Port T/R; MF: Amphenol; MP: 10118194-0001LF; PACKAGE: DIP-4 FCI; PRICE: 0.24 USD
USB-OUT = SparkFun-Connectors:USB_A: USB-A Connector Male and female variants, as well as PTH and SMT variants SparkFun Products: SparkFun XBee Explorer Dongle <https://www.sparkfun.com/products/11697> PTH Male SparkFun MicroView-USB Programmer <https://www.sparkfun.com/products/12924> SMT Male SparkFun USB Type A Female Breakout <https://www.sparkfun.com/products/12700> SMT Female; PROD_ID: CONN-09520; SF_ID: PRT-09011

## Board
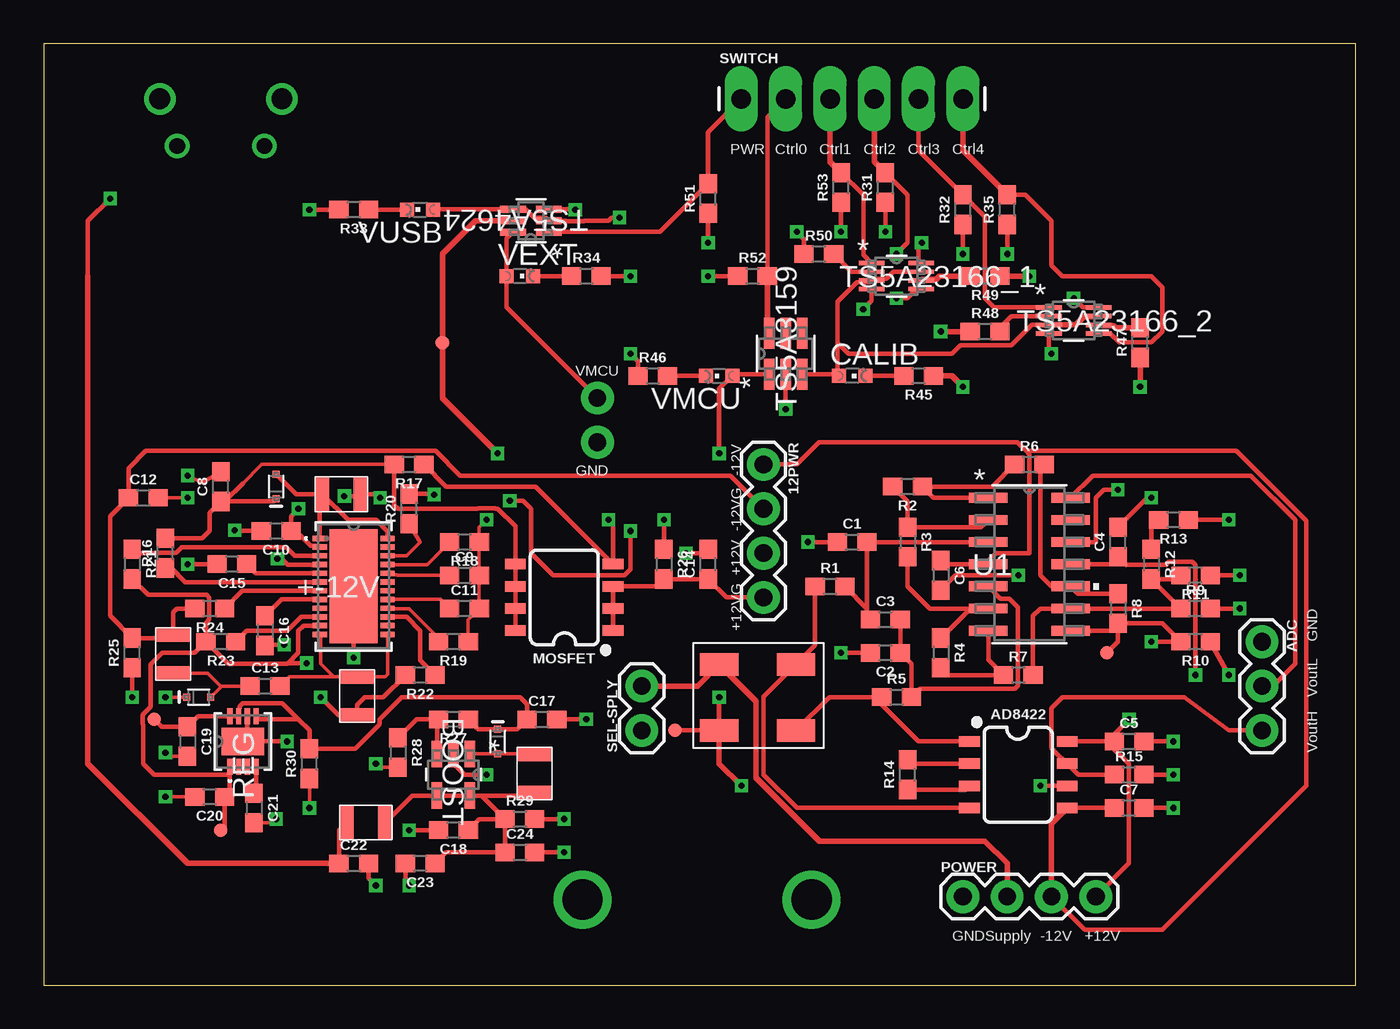
[diagram p4: board, top side]
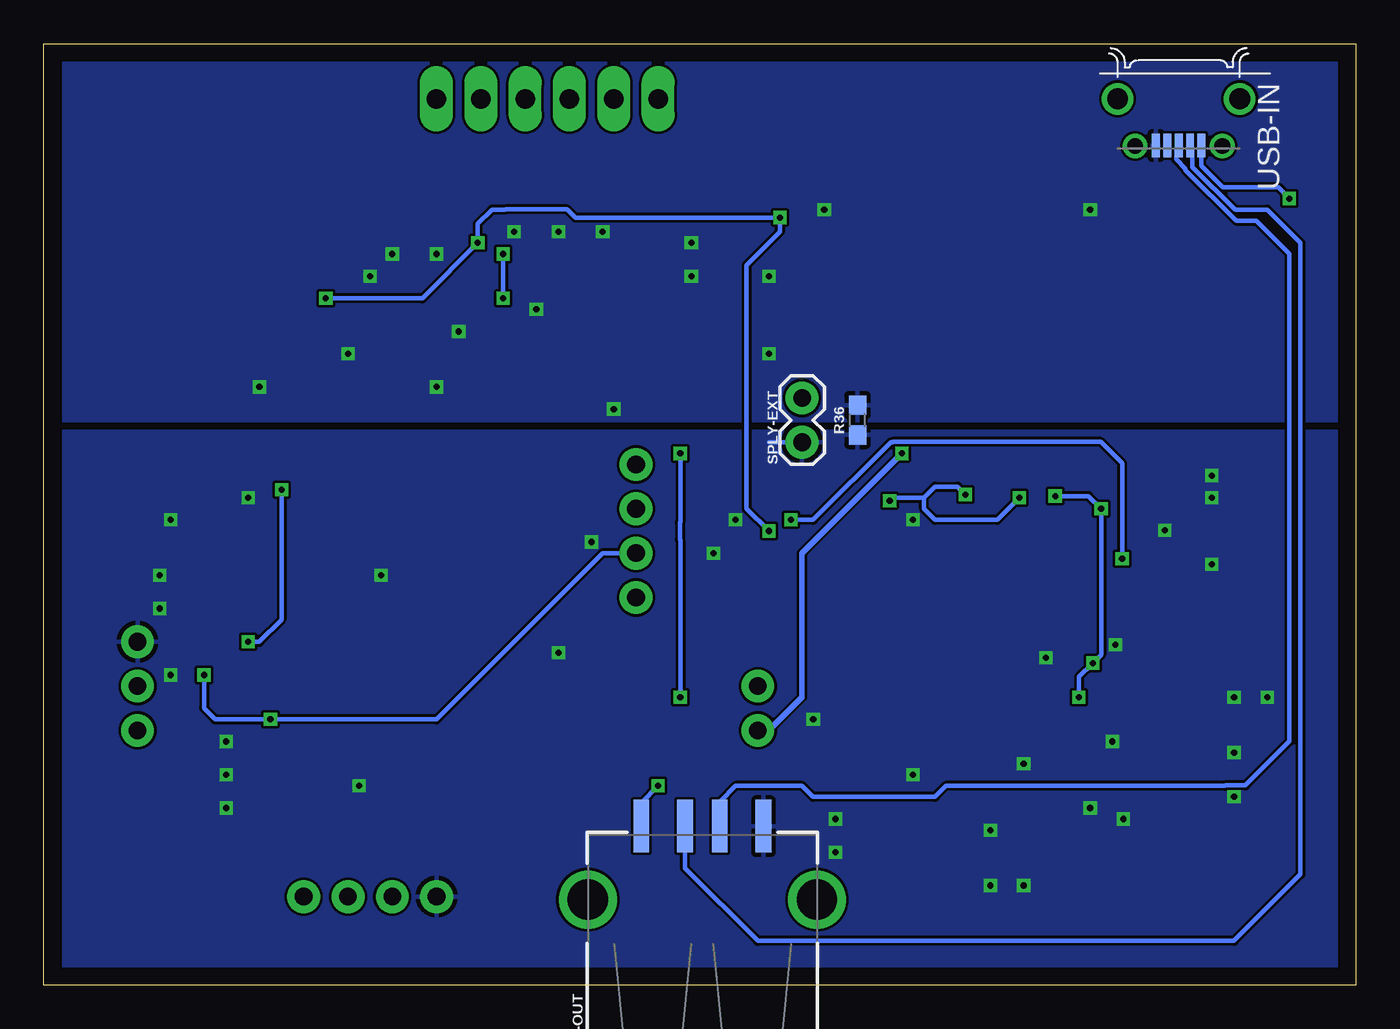
[diagram p5: board, bottom side, seen from below]

Size 75.23 x 53.97 mm. Coordinates in mm from the lower left corner, seen from the top.
Outline: 0,0 75.23,0 75.23,53.97 0,53.97 0,0
Copper layers (1*16): Top 0.035mm / dielectric 1.5mm / Bottom 0.035mm
Design rules "default": minimum track width 6mil, minimum drill 0.35mm, track to track 6mil, track to pad 6mil, pad to pad 6mil, via to via 6mil, smd to smd 6mil, copper to edge 40mil, drill to drill 6mil, minimum pad ring 10mil, minimum via ring 8mil, stop-mask expansion 4mil, vias tented up to drill 0mil, thermal gap 10mil

### Footprints (pad centres in the part's own frame; a part is rotated, then mirrored left to right if it is on the bottom)
1X04 = drill 1.016 pad 1.88: 1 0,0; 2 2.54,0; 3 5.08,0; 4 7.62,0
DFN-24_DKD = smd 0.813 x 0.305: 1 -1.943,2.75; 2 -1.943,2.25; 3 -1.943,1.75; 4 -1.943,1.25; 5 -1.943,0.75; 6 -1.943,0.25; 7 -1.943,-0.25; 8 -1.943,-0.75; 9 -1.943,-1.25; 10 -1.943,-1.75; 11 -1.943,-2.25; 12 -1.943,-2.75; 13 1.943,-2.75; 14 1.943,-2.25; 15 1.943,-1.75; 16 1.943,-1.25; 17 1.943,-0.75; 18 1.943,-0.25; 19 1.943,0.25; 20 1.943,0.75; 21 1.943,1.25; 22 1.943,1.75; 23 1.943,2.25; 24 1.943,2.75 | smd 2.74 x 6.53: 25 0,0
SO08 = smd 0.6 x 1.2: 1 -1.905,-2.8; 2 -0.635,-2.8; 3 0.635,-2.8; 4 1.905,-2.8; 5 1.905,2.8; 6 0.635,2.8; 7 -0.635,2.8; 8 -1.905,2.8
1X03 = drill 1.016 pad 1.88: 1 0,0; 2 2.54,0; 3 5.08,0
TSOT-23-5_D5-M = smd 1.524 x 0.61: 1 -1.194,0.95; 2 -1.194,0; 3 -1.194,-0.95; 4 1.194,-0.95; 5 1.194,0.95
0603 = smd 1.1 x 1: 1 -0.85,0; 2 0.85,0
CHIPLED_0603 = smd 0.8 x 0.8: A 0,-0.75; C 0,0.75
SOD-523 = smd 0.4 x 0.4: A -0.7,0; C 0.7,0
252012C = smd 2 x 0.8: 1 0.2,-0.4; 2 0.2,1.8
CP_8_21-M = smd 0.906 x 0.3: 1 -1.453,0.75; 2 -1.453,0.25; 3 -1.453,-0.25; 4 -1.453,-0.75; 5 1.453,-0.75; 6 1.453,-0.25; 7 1.453,0.25; 8 1.453,0.75 | smd 1.6 x 2.44: 9 0,0
1X02 = drill 1.016 pad 1.88: 1 0,0; 2 2.54,0
1X06_LONGPADS = drill 1.118 pad 1.88 long: 1 0,0; 2 2.54,0; 3 5.08,0; 4 7.62,0; 5 10.16,0; 6 12.7,0
PAD.03X.03 = smd 0.762 x 0.762: P$1 0,0
DBV6-M = smd 1.778 x 0.61: 1 -1.168,0.95; 2 -1.168,0; 3 -1.168,-0.95; 4 1.168,-0.95; 5 1.168,0; 6 1.168,0.95
DCK6-M = smd 1.473 x 0.406: 1 -1.029,0.65; 2 -1.029,0; 3 -1.029,-0.65; 4 1.029,-0.65; 5 1.029,0; 6 1.029,0.65
DCU8-M = smd 1.473 x 0.254: 1 -1.422,0.75; 2 -1.422,0.25; 3 -1.422,-0.25; 4 -1.422,-0.75; 5 1.422,-0.75; 6 1.422,-0.25; 7 1.422,0.25; 8 1.422,0.75
R_14 = smd 2.184 x 0.559: 1 -2.362,3.81; 2 -2.362,2.54; 3 -2.362,1.27; 4 -2.362,0; 5 -2.362,-1.27; 6 -2.362,-2.54; 7 -2.362,-3.81; 8 2.362,-3.81; 9 2.362,-2.54; 10 2.362,-1.27; 11 2.362,0; 12 2.362,1.27; 13 2.362,2.54; 14 2.362,3.81
HIPREC-SMD-SHUNT = smd 2.2 x 1.3: INFD 4.4,0; INFIZ 0,0; SUPD 4.4,3.78; SUPIZ 0,3.78
FRAMATOME_10118194-0001LF = smd 0.45 x 1.35: 1 -1.3,2.675; 2 -0.65,2.675; 3 0,2.675; 4 0.65,2.675; 5 1.3,2.675 | drill 0.9: P$6 -2.5,2.7; P$7 2.5,2.7 | drill 1.2: P$8 -3.5,0; P$9 3.5,0
USB-A-S-SILK-FEMALE = smd 3 x 0.9: D+ 7.212,-1; D- 7.212,1; GND 7.212,-3.5; VBUS 7.212,3.5 | drill 2.311: SHLD1 3,-6.566; SHLD2 3,6.566

### Placement (x,y rotation side)
12PWR  41.27,29.84 270 top
+-12V  17.78,22.86 0 top
AD8422  55.88,12.06 270 top
ADC  69.85,19.68 270 top
BOOST  23.5,12.06 270 top
C1  46.36,25.4 0 top
C2  48.26,19.05 180 top
C3  48.26,20.95 0 top
C4  61.59,25.4 90 top
C5  62.23,13.97 0 top
C6  51.44,23.5 270 top
C7  62.23,10.16 0 top
C8  10.16,28.57 90 top
C9  24.13,23.5 0 top
C10  13.33,26.04 180 top
C11  24.13,21.59 0 top
C12  5.71,27.94 0 top
C13  12.7,17.14 0 top
C14  38.1,24.13 90 top
C15  10.79,24.13 180 top
C16  12.7,20.32 270 top
C17  28.58,15.24 0 top
C18  23.5,8.89 180 top
C19  8.25,13.97 270 top
C20  9.53,10.79 180 top
C21  12.06,10.16 270 top
C22  17.78,6.98 0 top
C23  21.59,6.98 180 top
C24  27.3,7.62 0 top
CALIB  46.36,34.93 270 top
D1  26.04,13.97 90 top
D2  13.33,28.57 270 top
D3  8.89,16.51 180 top
L1  7.62,19.68 180 top
L2  27.94,11.43 0 top
L3  17.78,15.88 0 top
L4  17.78,27.94 90 top
L5  17.78,9.53 270 top
MOSFET  29.85,22.22 90 top
POWER  52.7,5.08 0 top
R1  45.09,22.86 0 top
R2  49.53,28.57 180 top
R3  49.53,25.4 270 top
R4  51.44,19.05 270 top
R5  48.9,16.51 0 top
R6  56.52,29.84 0 top
R7  55.88,17.78 0 top
R8  61.59,21.59 270 top
R9  66.04,21.59 0 top
R10  66.04,19.68 180 top
R11  66.04,23.5 180 top
R12  63.5,24.13 270 top
R13  64.77,26.67 180 top
R14  49.53,12.06 90 top
R15  62.23,12.06 0 top
R16  6.99,24.77 90 top
R17  20.96,29.84 180 top
R18  24.13,25.4 180 top
R19  23.5,19.68 180 top
R20  20.96,27.3 90 top
R21  5.08,24.13 270 top
R22  21.59,17.78 180 top
R23  10.16,19.68 180 top
R24  9.53,21.59 180 top
R25  5.08,19.05 90 top
R26  35.56,24.13 270 top
R27  23.5,15.24 180 top
R28  20.32,13.33 270 top
R29  27.3,9.53 0 top
R30  15.24,12.7 90 top
R31  48.26,45.72 90 top
R32  52.7,44.45 90 top
R33  17.78,44.45 180 top
R34  31.12,40.64 0 top
R35  55.25,44.45 90 top
R36  28.58,32.38 90 bottom
R45  50.16,34.93 180 top
R46  34.93,34.93 0 top
R47  62.87,36.83 90 top
R48  53.98,37.47 0 top
R49  53.98,40.64 180 top
R50  44.45,41.91 0 top
R51  38.1,45.09 90 top
R52  40.64,40.64 0 top
R53  45.72,45.72 90 top
REG  11.43,13.97 90 top
SEL-SPLY  34.29,14.61 90 top
SPLY-EXT  31.75,31.11 90 bottom
SWITCH  40.01,50.8 0 top
TP1  60.96,19.05 90 top
TP2  36.2,14.61 0 top
TP-5V5  6.35,15.24 90 top
TP-5VR  10.16,8.89 90 top
TP-MCUSPLY  22.86,36.83 90 top
TS5A3159  42.55,36.2 90 top
TS5A4624  27.94,43.82 180 top
TS5A23166_1  48.9,40.64 0 top
TS5A23166_2  59.05,38.1 0 top
U1  56.52,24.13 0 top
U$1  38.73,14.61 0 top
USB-IN  10.16,50.8 180 bottom
USB-OUT  37.47,1.91 90 bottom
VEXT  27.3,40.64 270 top
VMCU  38.73,34.93 90 top
VUSB  21.59,44.45 90 top

### Tracks (layer width: path | path; a pad name or v marks a point on that pad's centre or on a via)
5V5
  Top 0.254: REG.5 12.36,15.24 14.6,15.24 | 14.6,15.24 15.24,14.61 R30.2 17.85,13.55 19.26,14.96 19.26,15.24 20.53,16.51 27.3,16.51 27.73,16.09 C17.1 27.16,14.67 D1.C 24.92,14.67 R27.1 | TP-5V5.P$1 6.77,14.82 C19.1 8.86,15.42 REG.8 REG.7 11.18,15.8 11.25,15.88 11.25,15.99 11.41,16.16 13.69,16.16 14.6,15.24
5VIN  (via drill 0.35)
  Top 0.254: C22.1 16.93,8.88 L5.1 | 2.54,40.64 2.54,43.82 v3.81,45.09
  Top 0.305: 2.54,40.64 2.54,12.7 8.25,6.98 C22.1
  Bottom 0.254: v3.81,45.09 4.45,45.72 7.62,45.72 8.86,46.96 USB-IN.1
5VR  (via drill 0.35)
  Top 0.254: +-12V.11 14.89,20.61 14.6,20.32 14.6,19.05 14.02,18.46 | R23.2 10.58,18.41 13.97,18.41 14.02,18.46 | +-12V.2 15.77,25.18 15.31,25.18 14.46,26.04 C10.1 14.18,26.88 v14.6,27.3 | REG.3 REG.2 REG.1 10.68,12.06 | R22.2 19.47,16.51 18.42,16.51 17.98,16.07 L3.1 16.91,15.47 v15.88,16.51 | VUSB.A 22.36,44.47 TS5A4624.4 27.63,44.47 28.12,43.98 28.8,43.98 TS5A4624.2 29.96,43.82 29.99,43.79 30.97,43.79 31,43.82 32.38,43.82 32.56,43.99 v33.02,43.99 | TP-5VR.P$1 10.38,9.11 C20.1 10.68,11.1 10.68,12.06 | R23.2 9.31,20.78 9.5,20.97 9.5,22.21 9.34,22.37 5.99,22.37 R21.2 | R23.2 8.67,19.05 6.79,19.05 6.14,18.4 6.14,15.96 5.69,15.51 5.69,14.97 5.71,14.94 5.71,12.7 6.35,12.06 10.68,12.06 | v17.24,28.03 18.07,28.03 L4.1 19.09,28.14 v19.29,27.94 | v22.38,28.12 22.34,28.16 R20.2 | 14.02,18.46 v15.09,18.46 | TS5A23166_1.8 50.16,41.54 50.16,42.37 v50.34,42.55 | v59.05,39.37 59.58,38.85 TS5A23166_2.8 | v33.66,26.04 33.66,23.84 33.3,23.5 29.21,23.5 27.94,24.77 27.94,27.3 27.48,27.76 v26.73,27.76
  Bottom 0.254: v17.24,28.03 15.33,28.03 v14.6,27.3 14.6,18.95 v15.09,18.46 15.88,17.68 v15.88,16.51 | v19.29,27.94 20.56,26.67 24.13,26.67 24.77,27.3 24.77,27.94 | 24.77,27.94 24.13,28.57 22.84,28.57 v22.38,28.12 | v59.05,39.37 53.52,39.37 v50.34,42.55 50.34,43.64 49.53,44.45 48.78,44.45 48.75,44.47 45.23,44.47 44.75,43.99 v33.02,43.99 33.02,43.18 34.93,41.28 34.93,27.3 v33.66,26.04 | v26.73,27.76 26.55,27.94 24.77,27.94
5VUSB
  Top 0.254: L5.2 21.13,10.87 BOOST.4 BOOST.5 25.11,10.87 | 25.11,10.87 27.98,10.87 L2.1 | R29.1 25.11,10.87 | C18.1 24.98,9.53 R29.1 | R29.1 C24.1 23.08,7.62 C23.1
!SHDN1
  Top 0.203: R20.1 21.59,25.4 20.8,24.61 +-12V.22
!SHDN2
  Top 0.254: +-12V.15 20.8,21.11 21.59,20.32 21.59,18.63 R22.1
+12OUT
  Top 0.254: MOSFET.1 MOSFET.2 MOSFET.3 35.14,22.86 R26.2 C14.1 39.16,22.22 12PWR.4
+12V  (via drill 0.35)
  Top 0.254: U1.11 61.18,24.13 C4.1 62.04,24.11 64.36,24.11 64.52,24.27 65.86,24.27 66.02,24.11 66.02,23.34 66.05,23.25 66.04,23.23 v66.04,17.78 | AD8422.8 C5.1 | C5.1 61.38,13.51 62.21,12.68 62.21,7.01 62.23,6.98 POWER.4 | v62.23,15.24 61.38,14.39 C5.1
  Bottom 0.254: v66.04,17.78 66.04,15.88 65.41,15.24 v62.23,15.24 52.7,15.24 43.18,24.77 12PWR.3
+IN_A
  Top 0.254: U1.3 C1.2 47.2,21.59 | C3.1 47.2,21.16 47.2,21.59 | R1.2 47.2,21.59
+IN_B
  Top 0.254: C3.2 C2.1 49.75,18.41 R5.2 50.24,17 55.7,17 55.86,17.16 55.86,21.65 55.36,22.15 54.86,22.15 U1.5
+IN_C
  Top 0.254: R8.1 59.3,22.44 U1.10 57.79,22.86 57.15,23.5 57.15,29.63 R6.2
-12OUT
  Top 0.254: 12PWR.2 39.37,29.21 23.89,29.21 22.47,30.62 5.86,30.62 4.87,29.63 C12.1 3.81,26.88 3.81,21.17 R25.2 7.24,19.9 L1.1 7.42,21.39 7.62,21.59 R24.2
-12V
  Top 0.254: C6.1 51.65,24.13 53.98,24.13 | 53.98,24.13 U1.4 | AD8422.5 C7.1 | 12PWR.1 43.18,29.84 44.45,31.11 55.84,31.11 56.33,30.62 | 56.33,30.62 56.52,30.44 56.52,24.77 54.61,24.77 53.98,24.13 | 56.33,30.62 68.38,30.62 72.39,26.61 72.39,11.43 64.13,3.17 59.69,3.17 POWER.3
  Top 0.305: AD8422.5 57.79,9.27 POWER.3
-IN_A
  Top 0.254: U1.2 53.73,26.25 R3.1 49.53,27.72 R2.2
-IN_B
  Top 0.254: U1.6 53.98,21.59 53.12,21.59 | 53.12,21.59 R4.1 | R3.2 49.53,22.86 50.8,21.59 53.12,21.59
-IN_C
  Top 0.254: 64.77,21.59 U1.9 57.15,21.59 56.73,21.17 R7.2 | 64.77,21.59 R9.1 | R11.2 65.61,23.28 R12.2 64.77,22.01 64.77,21.59
DATA+
  Bottom 0.254: USB-IN.3 10.31,47.98 10.31,47.33 9.77,46.8 9.77,46.72 6.86,43.82 5.71,43.82 3.81,41.91 3.81,13.97 6.33,11.45 7.48,11.45 7.5,11.43 23.5,11.43 24.13,10.79 31.12,10.79 31.75,11.43 35.56,11.43 36.47,10.53 USB-OUT.D+
DATA-
  Bottom 0.254: USB-IN.2 9.36,47.98 9.36,46.89 6.92,44.45 5.08,44.45 3.17,42.55 3.17,6.35 6.99,2.54 34.29,2.54 38.47,6.71 USB-OUT.D-
DGND  (via drill 0.35)
  Top 0.254: R33.2 v15.24,44.45 | R51.1 v38.1,42.55 | TS5A4624.3 30.46,44.47 v30.48,44.45 | R50.1 43.6,42.76 v43.18,43.18 | R53.1 v45.72,43.18 | R31.1 v48.26,43.18 | R32.1 v52.7,41.91 | R35.1 v55.25,41.91 | TS5A23166_1.4 47.47,39.22 v46.99,38.74 | TS5A3159.2 v42.55,33.02 | R52.1 v38.1,40.64 | R34.2 v33.66,40.64 | TS5A23166_2.4 57.63,36.35 v57.79,36.2 | R46.1 34.08,35.78 v33.66,36.2
  Top 0.305: R47.1 v62.87,34.29 | R45.1 52.07,34.93 v52.7,34.29 | R48.1 v51.44,37.47 | R49.1 v56.52,40.64
  pour Bottom: 74.3,32.38 0,32.38 0,54.61 74.3,54.61
FB
  Top 0.254: R28.1 21.38,15.24 R27.2 22.55,15.14 BOOST.3
FBX1
  Top 0.254: R16.1 7.32,23.91 8.12,23.11 +-12V.6
FBX2
  Top 0.254: +-12V.7 11.39,22.61 R24.1
GATE1  (via drill 0.35)
  Top 0.254: R17.1 23.08,28.57 28.2,28.57 MOSFET.4 32.64,26.41 v32.38,26.67 | +-12V.4 13.99,24.11 13.65,24.45 v13.4,24.45
  Bottom 0.254: v13.4,24.45 13.4,29.91 14.63,31.14 26.53,31.14 26.55,31.11 26.67,31.11 31.12,26.67 v32.38,26.67
GND  (via drill 0.35)
  Top 0.203: C8.2 9.11,28.79 v8.25,29.21 | C12.2 v8.25,27.94 | D3.C v6.99,16.51 | C20.2 v6.99,10.79 | C19.2 7.2,13.12 v6.99,13.33 | R30.1 v15.24,10.16 | C21.2 13.12,9.31 v13.33,9.53 | R28.2 19.27,12.48 v19.05,12.7 | v25.4,26.67 24.98,26.25 R18.1 C9.2 C11.2 24.35,20.95 R19.1
  Top 0.254: R29.2 v29.85,9.53 | C24.2 v29.85,7.62 | C17.2 v31.12,15.24 | C22.2 18.63,6.13 v19.05,5.71 | C23.2 20.74,5.93 v20.96,5.71 | C18.2 v20.96,8.89 | v13.97,13.97 REG.9 11.68,14.22 REG.6 | +-12V.25 v17.78,18.76 | C15.2 v8.25,24.13 | C10.2 10.98,26.04 v10.95,26.07 | C16.2 12.74,19.51 v13.79,19.51 | R9.2 v68.58,21.59 | R10.1 v67.95,17.78 | R11.1 v68.58,23.5 | R13.1 v67.95,26.67 | C2.2 v45.72,19.05 | R26.1 v35.56,26.67 | C7.2 v64.77,10.16 | R15.2 v64.77,12.06 | C5.2 v64.77,13.97 | AD8422.6 v57.15,11.43 | C1.1 v43.81,25.4 | C6.2 52.29,23.5 v55.88,23.5 | C14.2 37.88,24.77 v36.83,24.77 | BOOST.2 23.5,12.7 24.13,12.06 v25.4,12.06 | C4.2 63.29,27.94 v63.5,27.94 | 4.87,18.41 R25.1 v5.08,16.51
  Bottom 0.254: SPLY-EXT.1 33.66,31.11
  pour Bottom: 0.64,31.75 74.3,31.75 74.3,0 0.64,0
N$7
  Top 0.254: AD8422.2 49.75,12.7 R14.2
N$10
  Top 0.254: AD8422.3 52.87,11.21 R14.1
N$12
  Top 0.254: VUSB.C R33.1
N$13
  Top 0.203: 11.43,28.76 12.51,29.84 R17.2
  Top 0.254: R17.2 20.11,27.52 20.32,27.3 24.88,27.3 24.91,27.33 25.89,27.33 25.92,27.3 26.04,27.3 27.05,26.29 MOSFET.5 MOSFET.6 MOSFET.7 MOSFET.8 | C8.1 13.18,27.72 D2.C | 11.43,28.76 10.39,27.72 C8.1 | C8.1 9.53,27.09 9.53,26.04 9.11,25.61 R16.2
N$14
  Top 0.203: D3.A 10.19,17.11 | 10.19,17.11 10.22,17.14 C13.1 | L1.2 9.42,17.88 10.19,17.11
N$19
  Top 0.254: R34.1 VEXT.C
N$20
  Top 0.254: REG.4 12.18,11.12 C21.1
N$23
  Top 0.254: CALIB.C R45.2
N$24
  Top 0.254: VMCU.C R46.2
N$30
  Top 0.254: TS5A23166_1.2 46.32,40.89 R50.2
N$31
  Top 0.305: TS5A23166_1.6 50.39,40.46 51.18,40.46 51.36,40.64 R49.2
N$32
  Top 0.254: TS5A23166_2.2 55.5,38.35 54.83,37.68 R48.2
N$33
  Top 0.305: R47.2 61.44,37.68 61.34,37.78 60.55,37.78 TS5A23166_2.6
OUT_A
  Top 0.254: U1.1 51.02,27.94 R2.1 54.4,28.57 R6.1
OUT_B
  Top 0.254: R4.2 51.86,17.78 R7.1 54.15,18.66 U1.7
OUT_C  (via drill 0.35)
  Top 0.254: U1.8 61.18,20.32 R8.2 | R8.2 64.13,20.74 R10.2 v63.5,19.68 | R8.2 61.59,19.68 TP1.P$1 | U1.12 60.33,25.4 60.33,27.3 60.33,27.94 60.78,28.4 v61.59,28.4
  Bottom 0.254: v61.59,28.4 61.59,20.95 62.87,19.68 v63.5,19.68
OUT_D
  Top 0.254: R13.2 63.5,26.25 R12.1
PG1
  Top 0.254: +-12V.3 14.39,24.61 13.9,25.11 7.92,25.11 7.6,24.79 6.37,24.79 6.35,24.77 5.29,24.77 R21.1
PG2
  Top 0.254: +-12V.10 14.76,21.11 13.97,20.32 11.64,20.32 R23.1
RT1
  Top 0.203: R18.2 21.99,24.11 +-12V.21
RT2
  Top 0.203: +-12V.16 19.74,21.59 20.96,21.59 22.64,19.9 R19.2
SHUNT+
  Top 0.254: R1.1 44.23,19.48 U$1.SUPD 41.27,16.53 41.27,12.06 43.18,10.16 AD8422.4
SHUNT-
  Top 0.254: R5.1 47.62,16.51 | 47.62,16.51 45.04,16.51 U$1.INFD | AD8422.1 50.16,13.97 47.62,16.51
SS1
  Top 0.203: C9.1 20.26,23.5 20.23,23.52 19.82,23.52 +-12V.20
SS2
  Top 0.203: +-12V.17 22.76,22.11 C11.1
SW
  Top 0.203: BOOST.1 26.02,13.26 D1.A 28.1,13.27 L2.2
SW_CTRL_0
  Top 0.254: SWITCH.2 41.49,49.75 R52.2
  Top 0.305: TS5A3159.6 41.49,37.47 R52.2
SW_CTRL_1
  Top 0.254: R53.2 46.99,45.3 46.99,41.87 TS5A23166_1.1
  Top 0.305: SWITCH.3 45.09,47.21 R53.2
SW_CTRL_2  (via drill 0.35)
  Top 0.254: R31.2 49.53,45.3 49.53,42.55 v48.9,41.91 | v48.9,39.37 49.53,39.37 50.05,39.89 TS5A23166_1.5
  Top 0.305: SWITCH.4 47.62,47.21 R31.2
  Bottom 0.254: v48.9,41.91 v48.9,39.37
SW_CTRL_3
  Top 0.254: SWITCH.5 50.16,47.84 R32.2 53.98,44.03 53.98,39.37 54.5,38.85 TS5A23166_2.1
SW_CTRL_4
  Top 0.254: TS5A23166_2.5 61.16,37.35 61.66,36.85 63.52,36.85 64.13,37.47 64.13,40.01 63.5,40.64 58.42,40.64 57.79,41.28 57.79,43.82 56.3,45.3 R35.2
  Top 0.305: R35.2 52.7,47.84 SWITCH.6
SW_CTRL_PWR
  Top 0.254: TS5A4624.1 28.98,43.18 35.34,43.18 R51.2 38.1,48.9 SWITCH.1
SWB1
  Top 0.254: D2.A 14.47,28.14 L4.2 | L4.2 15.84,28 +-12V.1 | L4.2 17.45,26.67 19.05,26.67 19.72,26 +-12V.24
SWB2
  Top 0.203: +-12V.12 15.88,20.07 15.88,18.41 16.62,17.68 | 16.62,17.68 17.14,17.68 L3.2 19.58,17.68 19.72,17.82 +-12V.13 | C13.2 14.08,17.68 16.62,17.68
V_CALIB
  Top 0.254: TS5A23166_2.3 56.66,37.85 55.49,36.69 52.56,36.69 52.07,36.2 46.14,36.2 45.5,36.83 | TS5A3159.3 45.5,35.03 | 45.5,35.03 CALIB.A | 45.5,36.83 45.5,39.18 46.62,40.3 47.38,40.3 TS5A23166_1.3 47.57,40.48 48.33,40.48 48.73,40.89 TS5A23166_1.7 | 45.5,36.83 45.5,35.03
  Top 0.305: TS5A23166_2.7 60.44,38.31 59.64,38.31 59.18,37.85 TS5A23166_2.3
VC1
  Top 0.254: +-12V.5 12.16,23.61 C15.1
VC2
  Top 0.254: +-12V.8 13.64,22.11 C16.1
VEXT
  Top 0.254: TS5A4624.6 26.55,42.81 VEXT.A 26.55,38.85 SPLY-EXT.2
VHOUT
  Top 0.254: R15.1 59.31,12.06 AD8422.7 57.99,13.39 57.96,13.39 57.79,13.57 57.79,15.88 58.42,16.51 65.41,16.51 67.95,14.61 ADC.3
VLOUT
  Top 0.254: U1.14 60.15,29.21 69.22,29.21 71.75,26.67 71.75,18.41 70.48,17.14 ADC.2
VSPLY
  Top 0.305: SEL-SPLY.2 37.5,17.14 U$1.SUPIZ 40.84,16.28 40.84,11.89 44.47,8.26 53.98,8.26 55.25,6.98 POWER.2
VSPLY1  (via drill 0.35)
  Top 0.305: TS5A4624.5 24.77,43.82 22.86,41.91 TP-MCUSPLY.P$1 22.86,33.66 v26.04,30.48
  Bottom 0.305: v26.04,30.48 31.75,24.77 31.75,16.51 33.66,14.61 SEL-SPLY.1
VSS  (via drill 0.35)
  Top 0.254: TP2.P$1 U$1.INFIZ v38.73,16.51 | TS5A3159.1 39.59,35.03 VMCU.A 38.73,34.18 v38.73,30.48
  Top 0.305: U$1.INFIZ 38.73,12.7 v40.01,11.43
  Bottom 0.254: v38.73,30.48 38.73,26.55 38.76,26.53 38.76,25.54 38.73,25.52 v38.73,16.51 | v40.01,11.43 40.97,10.47 USB-OUT.VBUS

### Text on the board
tNames: PWR | Ctrl0 | Ctrl1 | Ctrl2 | Ctrl3 | Ctrl4 | VMCU | GND | -12V | -12VG | +12V | +12VG | GND | VoutL | VoutH | GND | Supply | -12V | +12V